# Altium project Sophia_Lake.PrjPcb (part 1 of 4)
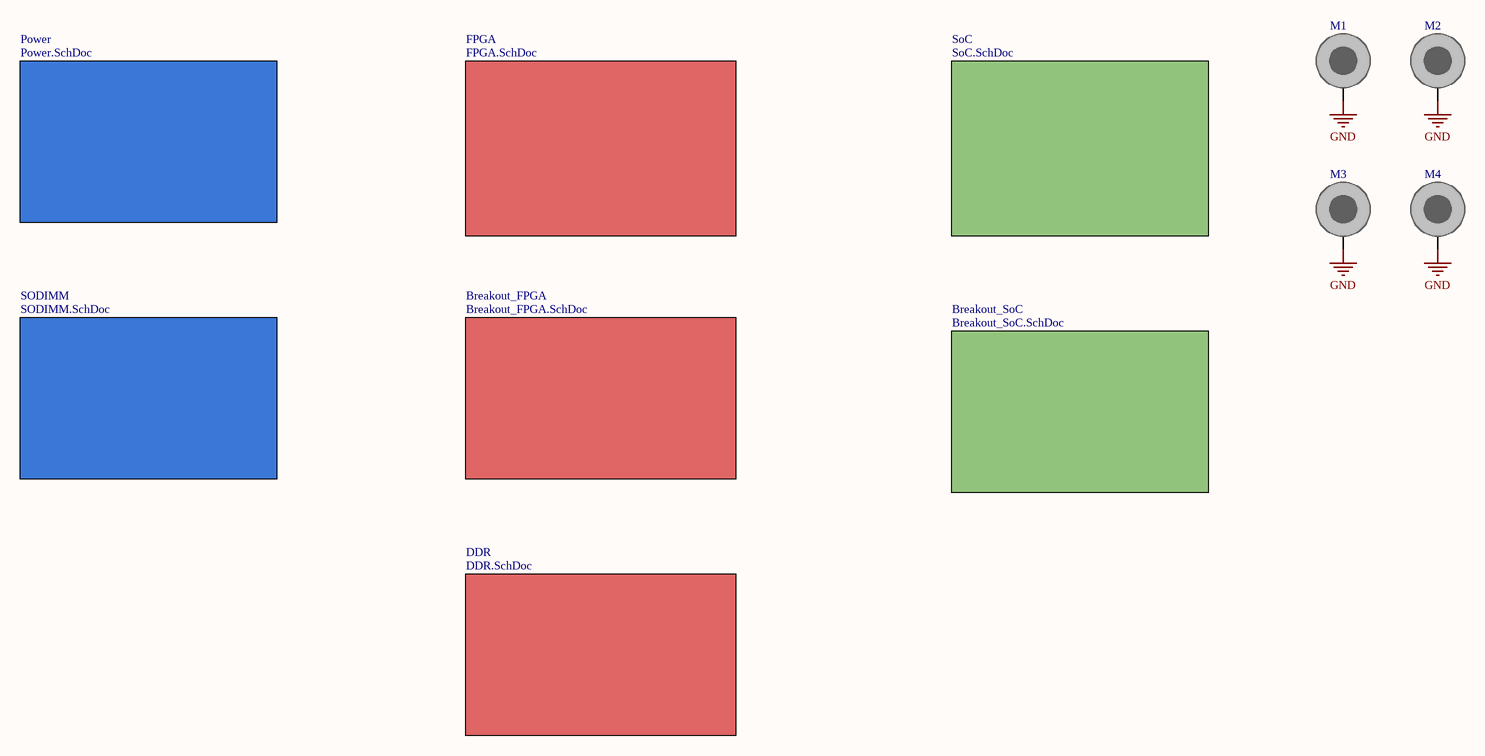
[diagram p0: Main.SchDoc]
8 sheets, 485 parts. Net scope: global (net labels, ports and power ports of the same name join across sheets).
Board file: Sophia_Lake.PcbDoc
Sheets:
  Main.SchDoc
    Breakout_SoC = Breakout_SoC.SchDoc
    Power = Power.SchDoc
    SODIMM = SODIMM.SchDoc
    FPGA = FPGA.SchDoc
    DDR = DDR.SchDoc
    SoC = SoC.SchDoc
    Breakout_FPGA = Breakout_FPGA.SchDoc

## Sheet Main.SchDoc
size C; DocumentNumber: 1; SheetNumber: 1; SheetTotal: 8

### Parts
M1  DNP/MH  [SCH_M3]  (value not drawn)  (no BOM)
M2  DNP/MH  [SCH_M3]  (value not drawn)  (no BOM)
M3  DNP/MH  [SCH_M3]  (value not drawn)  (no BOM)
M4  DNP/MH  [SCH_M3]  (value not drawn)  (no BOM)

### Sub-sheets
Breakout_FPGA = Breakout_FPGA.SchDoc: no entries
Breakout_SoC = Breakout_SoC.SchDoc: no entries
DDR = DDR.SchDoc: no entries
FPGA = FPGA.SchDoc: no entries
Power = Power.SchDoc: no entries
SoC = SoC.SchDoc: no entries
SODIMM = SODIMM.SchDoc: no entries

### Nets
GND: M1.1 M2.1 M3.1 M4.1

### Library data of the parts
M1-M4 = SCMH_M3: SCREW mouting, M3, 3.0mm diameter and 6.0mm PanHead; ASSEMBLY: DNP; VALUE: DNP/MH

## Sheet Breakout_SoC.SchDoc
size C; DocumentNumber: 8; SheetNumber: 8; SheetTotal: 8
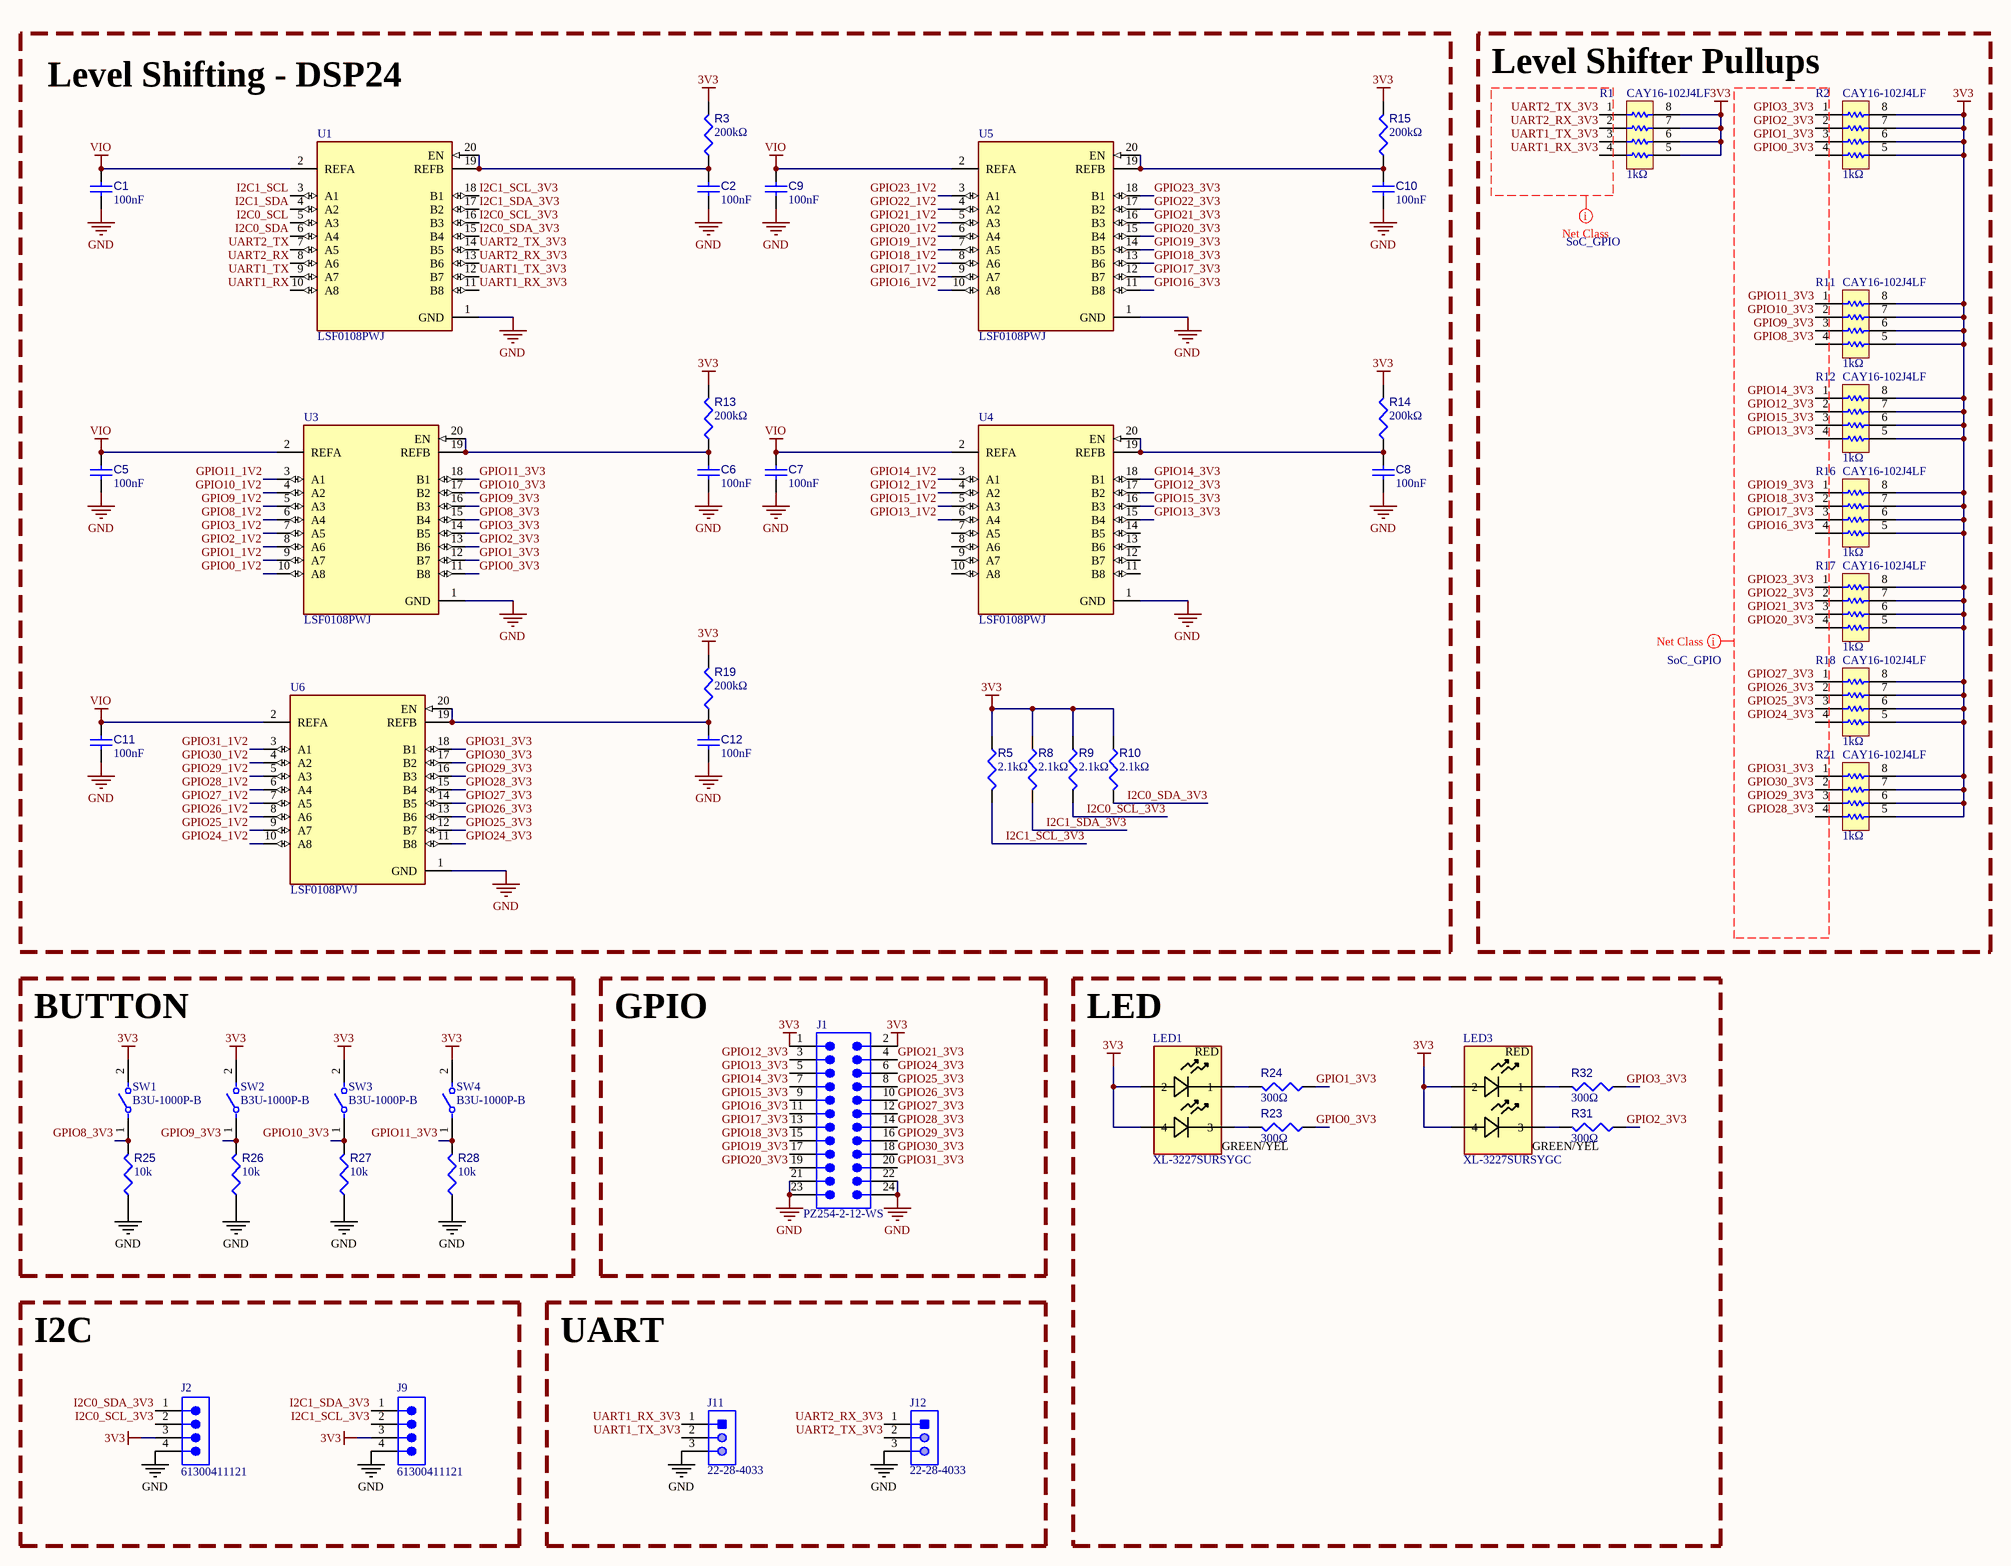
[diagram p1: Breakout_SoC.SchDoc]

### Parts
C1  value 100nF  [CAP-0402-MFG]  (hidden comment: CL05B104KO5VPNC)
C2  value 100nF  [CAP-0402-MFG]  (hidden comment: CL05B104KO5VPNC)
C5  value 100nF  [CAP-0402-MFG]  (hidden comment: CL05B104KO5VPNC)
C6  value 100nF  [CAP-0402-MFG]  (hidden comment: CL05B104KO5VPNC)
C7  value 100nF  [CAP-0402-MFG]  (hidden comment: CL05B104KO5VPNC)
C8  value 100nF  [CAP-0402-MFG]  (hidden comment: CL05B104KO5VPNC)
C9  value 100nF  [CAP-0402-MFG]  (hidden comment: CL05B104KO5VPNC)
C10  value 100nF  [CAP-0402-MFG]  (hidden comment: CL05B104KO5VPNC)
C11  value 100nF  [CAP-0402-MFG]  (hidden comment: CL05B104KO5VPNC)
C12  value 100nF  [CAP-0402-MFG]  (hidden comment: CL05B104KO5VPNC)
J1  PZ254-2-12-WS  [610124249121]
J2  61300411121  [61300411121]
J9  61300411121  [61300411121]
J11  22-28-4033  [MOLX-22-28-4033_V]
J12  22-28-4033  [MOLX-22-28-4033_V]
LED1  XL-3227SURSYGC  [LED-1210-4P-MFG]
LED3  XL-3227SURSYGC  [LED-1210-4P-MFG]
R1  CAY16-102J4LF  value 1kΩ  [RES-4x0603-MFG]
R2  CAY16-102J4LF  value 1kΩ  [RES-4x0603-MFG]
R3  value 200kΩ  [RES-0402]  (hidden comment: AC0402FR-07200KL)
R5  value 2.1kΩ  [RES-0402]  (hidden comment: CRCW04022K10FKED)
R8  value 2.1kΩ  [RES-0402]  (hidden comment: CRCW04022K10FKED)
R9  value 2.1kΩ  [RES-0402]  (hidden comment: CRCW04022K10FKED)
R10  value 2.1kΩ  [RES-0402]  (hidden comment: CRCW04022K10FKED)
R11  CAY16-102J4LF  value 1kΩ  [RES-4x0603-MFG]
R12  CAY16-102J4LF  value 1kΩ  [RES-4x0603-MFG]
R13  value 200kΩ  [RES-0402]  (hidden comment: AC0402FR-07200KL)
R14  value 200kΩ  [RES-0402]  (hidden comment: AC0402FR-07200KL)
R15  value 200kΩ  [RES-0402]  (hidden comment: AC0402FR-07200KL)
R16  CAY16-102J4LF  value 1kΩ  [RES-4x0603-MFG]
R17  CAY16-102J4LF  value 1kΩ  [RES-4x0603-MFG]
R18  CAY16-102J4LF  value 1kΩ  [RES-4x0603-MFG]
R19  value 200kΩ  [RES-0402]  (hidden comment: AC0402FR-07200KL)
R21  CAY16-102J4LF  value 1kΩ  [RES-4x0603-MFG]
R23  value 300Ω  [RES-0402]  (hidden comment: AC0402FR-07300RL)
R24  value 300Ω  [RES-0402]  (hidden comment: AC0402FR-07300RL)
R25  value 10k  [RES-0402]  (hidden comment: AC0402FR-0710KL)
R26  value 10k  [RES-0402]  (hidden comment: AC0402FR-0710KL)
R27  value 10k  [RES-0402]  (hidden comment: AC0402FR-0710KL)
R28  value 10k  [RES-0402]  (hidden comment: AC0402FR-0710KL)
R31  value 300Ω  [RES-0402]  (hidden comment: AC0402FR-07300RL)
R32  value 300Ω  [RES-0402]  (hidden comment: AC0402FR-07300RL)
SW1  B3U-1000P-B  [FP-B3U-1000P-B-MFG]
SW2  B3U-1000P-B  [FP-B3U-1000P-B-MFG]
SW3  B3U-1000P-B  [FP-B3U-1000P-B-MFG]
SW4  B3U-1000P-B  [FP-B3U-1000P-B-MFG]
U1  LSF0108PWJ  [FP-TSSOP20-MFG]
U3  LSF0108PWJ  [FP-TSSOP20-MFG]
U4  LSF0108PWJ  [FP-TSSOP20-MFG]
U5  LSF0108PWJ  [FP-TSSOP20-MFG]
U6  LSF0108PWJ  [FP-TSSOP20-MFG]

### Blocks framed on the sheet
Level Shifting - DSP24: C1 C2 C5-C12 R3 R5 R8-R10 R13-R15 R19 U1 U3-U6
Level Shifter Pullups: R1 R2 R11 R12 R16-R18 R21
BUTTON: R25-R28 SW1-SW4
GPIO: J1
LED: LED1 LED3 R23 R24 R31 R32
I2C: J2 J9
UART: J11 J12

### Nets
3V3: J1.1 J1.2 J2.3 J9.3 LED1.2 LED1.4 LED3.2 LED3.4 R1.5 R1.6 R1.7 R1.8 R2.5 R2.6 R2.7 R2.8 R3.2 R5.1 R8.1 R9.1 R10.1 R11.5 R11.6 R11.7 R11.8 R12.5 R12.6 R12.7 R12.8 R13.2 R14.2 R15.2 R16.5 R16.6 R16.7 R16.8 R17.5 R17.6 R17.7 R17.8 R18.5 R18.6 R18.7 R18.8 R19.2 R21.5 R21.6 R21.7 R21.8 SW1.2 SW2.2 SW3.2 SW4.2
GND: C1.1 C2.2 C5.1 C6.2 C7.1 C8.2 C9.1 C10.2 C11.2 C12.2 J1.21 J1.22 J1.23 J1.24 J2.4 J9.4 J11.3 J12.3 R25.1 R26.1 R27.1 R28.1 U1.1(GND) U3.1(GND) U4.1(GND) U5.1(GND) U6.1(GND)
VIO: C1.2 C5.2 C7.2 C9.2 C11.1 U1.2(REFA) U3.2(REFA) U4.2(REFA) U5.2(REFA) U6.2(REFA)
GPIO0_1V2: U3.10(A8)
GPIO0_3V3: R2.4 R23.2 U3.11(B8)
GPIO1_1V2: U3.9(A7)
GPIO1_3V3: R2.3 R24.2 U3.12(B7)
GPIO2_1V2: U3.8(A6)
GPIO2_3V3: R2.2 R31.2 U3.13(B6)
GPIO3_1V2: U3.7(A5)
GPIO3_3V3: R2.1 R32.2 U3.14(B5)
GPIO8_1V2: U3.6(A4)
GPIO8_3V3: R11.4 R25.2 SW1.1 U3.15(B4)
GPIO9_1V2: U3.5(A3)
GPIO9_3V3: R11.3 R26.2 SW2.1 U3.16(B3)
GPIO10_1V2: U3.4(A2)
GPIO10_3V3: R11.2 R27.2 SW3.1 U3.17(B2)
GPIO11_1V2: U3.3(A1)
GPIO11_3V3: R11.1 R28.2 SW4.1 U3.18(B1)
GPIO12_1V2: U4.4(A2)
GPIO12_3V3: J1.3 R12.2 U4.17(B2)
GPIO13_1V2: U4.6(A4)
GPIO13_3V3: J1.5 R12.4 U4.15(B4)
GPIO14_1V2: U4.3(A1)
GPIO14_3V3: J1.7 R12.1 U4.18(B1)
GPIO15_1V2: U4.5(A3)
GPIO15_3V3: J1.9 R12.3 U4.16(B3)
GPIO16_1V2: U5.10(A8)
GPIO16_3V3: J1.11 R16.4 U5.11(B8)
GPIO17_1V2: U5.9(A7)
GPIO17_3V3: J1.13 R16.3 U5.12(B7)
GPIO18_1V2: U5.8(A6)
GPIO18_3V3: J1.15 R16.2 U5.13(B6)
GPIO19_1V2: U5.7(A5)
GPIO19_3V3: J1.17 R16.1 U5.14(B5)
GPIO20_1V2: U5.6(A4)
GPIO20_3V3: J1.19 R17.4 U5.15(B4)
GPIO21_1V2: U5.5(A3)
GPIO21_3V3: J1.4 R17.3 U5.16(B3)
GPIO22_1V2: U5.4(A2)
GPIO22_3V3: R17.2 U5.17(B2)
GPIO23_1V2: U5.3(A1)
GPIO23_3V3: R17.1 U5.18(B1)
GPIO24_1V2: U6.10(A8)
GPIO24_3V3: J1.6 R18.4 U6.11(B8)
GPIO25_1V2: U6.9(A7)
GPIO25_3V3: J1.8 R18.3 U6.12(B7)
GPIO26_1V2: U6.8(A6)
GPIO26_3V3: J1.10 R18.2 U6.13(B6)
GPIO27_1V2: U6.7(A5)
GPIO27_3V3: J1.12 R18.1 U6.14(B5)
GPIO28_1V2: U6.6(A4)
GPIO28_3V3: J1.14 R21.4 U6.15(B4)
GPIO29_1V2: U6.5(A3)
GPIO29_3V3: J1.16 R21.3 U6.16(B3)
GPIO30_1V2: U6.4(A2)
GPIO30_3V3: J1.18 R21.2 U6.17(B2)
GPIO31_1V2: U6.3(A1)
GPIO31_3V3: J1.20 R21.1 U6.18(B1)
I2C0_SCL: U1.5(A3)
I2C0_SCL_3V3: J2.2 R9.2 U1.16(B3)
I2C0_SDA: U1.6(A4)
I2C0_SDA_3V3: J2.1 R10.2 U1.15(B4)
I2C1_SCL: U1.3(A1)
I2C1_SCL_3V3: J9.2 R5.2 U1.18(B1)
I2C1_SDA: U1.4(A2)
I2C1_SDA_3V3: J9.1 R8.2 U1.17(B2)
UART1_RX: U1.10(A8)
UART1_RX_3V3: J11.1 R1.4 U1.11(B8)
UART1_TX: U1.9(A7)
UART1_TX_3V3: J11.2 R1.3 U1.12(B7)
UART2_RX: U1.8(A6)
UART2_RX_3V3: J12.1 R1.2 U1.13(B6)
UART2_TX: U1.7(A5)
UART2_TX_3V3: J12.2 R1.1 U1.14(B5)
NetC2_1: C2.1 R3.1 U1.19(REFB) U1.20(EN)
NetC6_1: C6.1 R13.1 U3.19(REFB) U3.20(EN)
NetC8_1: C8.1 R14.1 U4.19(REFB) U4.20(EN)
NetC10_1: C10.1 R15.1 U5.19(REFB) U5.20(EN)
NetC12_1: C12.1 R19.1 U6.19(REFB) U6.20(EN)
NetLED1_1: LED1.1 R24.1
NetLED1_3: LED1.3 R23.1
NetLED3_1: LED3.1 R32.1
NetLED3_3: LED3.3 R31.1

Not connected (* = marked no-connect by the designer): U4 7(A5) 8(A6) 9(A7) 10(A8) 11(B8) 12(B7) 13(B6) 14(B5)

### Layout directives
net class SoC_GPIO: GPIO0_3V3, GPIO1_3V3, GPIO2_3V3, GPIO3_3V3, GPIO8_3V3, GPIO9_3V3, GPIO10_3V3, GPIO11_3V3, GPIO12_3V3, GPIO13_3V3, GPIO14_3V3, GPIO15_3V3, GPIO16_3V3, GPIO17_3V3, GPIO18_3V3, GPIO19_3V3, GPIO20_3V3, GPIO21_3V3, GPIO22_3V3, GPIO23_3V3, GPIO24_3V3, GPIO25_3V3, GPIO26_3V3, GPIO27_3V3, GPIO28_3V3, GPIO29_3V3, GPIO30_3V3, GPIO31_3V3, UART1_RX_3V3, UART1_TX_3V3, UART2_RX_3V3, UART2_TX_3V3

### Notes on the sheet
- (in symbol CMP-132-000003-3) RED; GREEN/YEL

### Library data of the parts
C1 C2 C5-C12 = CMP-104-000086-6: 0402-100n-10%-16V-X7R-AECQ200; Manufacturer Name: Murata; Capacitor Type: Ceramic; Voltage Rating: 16V; Tolerance: 10%; Temp Code: X7R; Component Type: Standard; Min Operating Temperature: -55°C; Source: Components - 11.02.26 - 17.26.SchLib; Design Item ID: CMP-001-00111-7; Pin Count: 2; Max Operating Temperature: 125°C; Case/Package: 0402; Pins: 2; Info: 0402-100n-10%-16V-X7R-AECQ200; Manufacturer Part Number: CL05B104KO5VPNC; Mounting Technology: Surface Mount; JLC PN: C307332
J1 = CMP-055-000215-1: Pin Header, 2.54MM Pitch, SMT Double Row Right Angled, 24 Pins; Manufacturer Name: HCTL; Current Rating: 3A; Connector Type: Male Pin; Gender: Male; Operating Supply Voltage: 250V; Pitch: 2.54mm; Termination: Solder; Number of Rows: 2; Pins: 24; Mounting Technology: Surface Mount; JLC PN: C5149362; Max Operating Temperature: 105°C; Manufacturer Part Number: PZ254-2-12-WS; Min Operating Temperature: -40°C
J2 J9 = CMP-00022-2: Conn Unshrouded Header HDR 4 POS 2.54mm Solder ST Thru-Hole Bag; Manufacturer Name: Wurth Electronik; Contact Resistance: 20mΩ; Current Rating: 3A; Voltage Rating: 250V; Connector Type: Male Pin; Gender: Male; Number of Rows: 1; Pitch: 2.54mm; Termination: Solder; Min Operating Temperature: -40°C; Max Operating Temperature: 105°C; JLC PN: C5184785; Manufacturer Part Number: 61300411121; Mounting Technology: Through Hole; Pins: 4
J11 J12 = CMP-055-000016-2: Board Connector, 3 Contact(s), 1 Row(s), Male, Straight, 0.1 inch Pitch, Solder Terminal, Receptacle; Manufacturer Name: Molex; JLC PN: 587037; Manufacturer Part Number: 22-28-4033
LED1 LED3 = CMP-132-000003-3: LED indicator light dual color red yellow green 1210 front facing; Manufacturer Name: XINLIGHT; Manufacturer Part Number: XL-3227SURSYGC; JLC PN: C965843
R1 R2 R11 R12 R16-R18 R21 = CMP-014-000102-1: Res Thick Film Array 1K Ohm 5% 0.25W(1/4W) ±200ppm/C ISOL 8-Pin 1206(4 X 0603) Convex SMD T/R; Manufacturer Name: Bourns; Number of Resistors: 4; Voltage Rating (DC): 50V; Power Dissipation: 250mW; Mounting Technology: Surface Mount; Tolerance: 5%; Manufacturer Part Number: CAY16-102J4LF; Min Operating Temperature: -55°C; JLC PN: C784824; Case/Package: 0603; Max Operating Temperature: 125°C; Pins: 8
R3 R13-R15 R19 = CMP-014-000126-4: 0402-200k-1%-1/16W-AEC-Q200; Manufacturer Name: YAGEO; Tolerance: 1%; Power: 63mW; Voltage Rating: 50V; Design Item ID: CMP-009-00210-1; Case/Package: 0402; Source: Components - 11.02.26 - 17.27.SchLib; Mounting Technology: Surface Mount; Min Operating Temperature: -55°C; Info: 0402-200k-1%-1/16W-AEC-Q200; Max Operating Temperature: 155°C; Pins: 2; Manufacturer Part Number: AC0402FR-07200KL; JLC PN: C144785
R5 R8-R10 = CMP-014-000127-3: 0402-2.1k-1%-1/16W-AEC-Q200; Manufacturer Name: Vishay; Power: 63mW; Tolerance: 1%; Voltage Rating: 50V; Max Operating Temperature: 155°C; Pins: 2; Design Item ID: CMP-009-00190-1; Info: 0402-2.1k-1%-1/16W-AEC-Q200; Manufacturer Part Number: CRCW04022K10FKED; Mounting Technology: Surface Mount; Component Type: Standard; Case/Package: 0402; Source: Components - 11.02.26 - 17.27.SchLib; Min Operating Temperature: -55°C; Pin Count: 2; JLC PN: C2091566
R23 R24 R31 R32 = CMP-014-000122-4: 0402-300-1%-1/16W-AEC-Q200; Manufacturer Name: YAGEO; Voltage Rating: 50V; Power: 63mW; Tolerance: 1%; Case/Package: 0402; Info: 0402-300-1%-1/16W-AEC-Q200; Pins: 2; Source: Components - 11.02.26 - 17.27.SchLib; Manufacturer Part Number: AC0402FR-07300RL; Max Operating Temperature: 155°C; Mounting Technology: Surface Mount; Design Item ID: CMP-009-00210-1; Min Operating Temperature: -55°C; JLC PN: C144768
R25-R28 = CMP-014-000077-5: 0402-10k-1%-1/16W-AEC-Q200; Manufacturer Name: YAGEO; Tolerance: 1%; Voltage Rating: 50V; Power: 63mW; Pins: 2; Source: Components - 11.02.26 - 17.27.SchLib; Manufacturer Part Number: AC0402FR-0710KL; Info: 0402-10k-1%-1/16W-AEC-Q200; Min Operating Temperature: -55°C; Pin Count: 2; Case/Package: 0402; Design Item ID: CMP-009-00191-3; Max Operating Temperature: 155°C; Component Type: Standard; Mounting Technology: Surface Mount; JLC PN: C144807
SW1-SW4 = CMP-015-000062-1: Switch Tactile N.O. SPST Round Button Gull Wing 0.05A 12VDC 1.5N SMD Embossed T/R; Manufacturer Name: Omron; Contact Resistance: 100mΩ; Switch Function: Off-Mom; Max Current Rating: 50mA; Voltage Rating (DC): 12V; Manufacturer Part Number: B3U-1000P-B; Switch Type: SPST; Max Operating Temperature: 70°C; Mounting Technology: Surface Mount; JLC PN: C231329; Min Operating Temperature: -25°C
U1 U3-U6 = CMP-051-000053-3: LSF0108 - 8-bit bidirectional multi-voltage level translator; open-drain; push-pull; Manufacturer Name: Nexperia; Operating Supply Current: 128mA; Number of Channels: 8; Min Supply Voltage: 950mV; Data Rate: 200Mbps; Max Supply Voltage: 5V; Topology: Open-Drain, Push-Pull; Pins: 20; Logic Function: Translator; Max Operating Temperature: 125°C; Min Operating Temperature: -40°C; Mounting Technology: Surface Mount; Channel Type: Bidirectional; JLC PN: C551522; Case/Package: TSSOP; Height: 1.1mm; Manufacturer Part Number: LSF0108PWJ

## Sheet Power.SchDoc
size C; DocumentNumber: 3; SheetNumber: 3; SheetTotal: 8
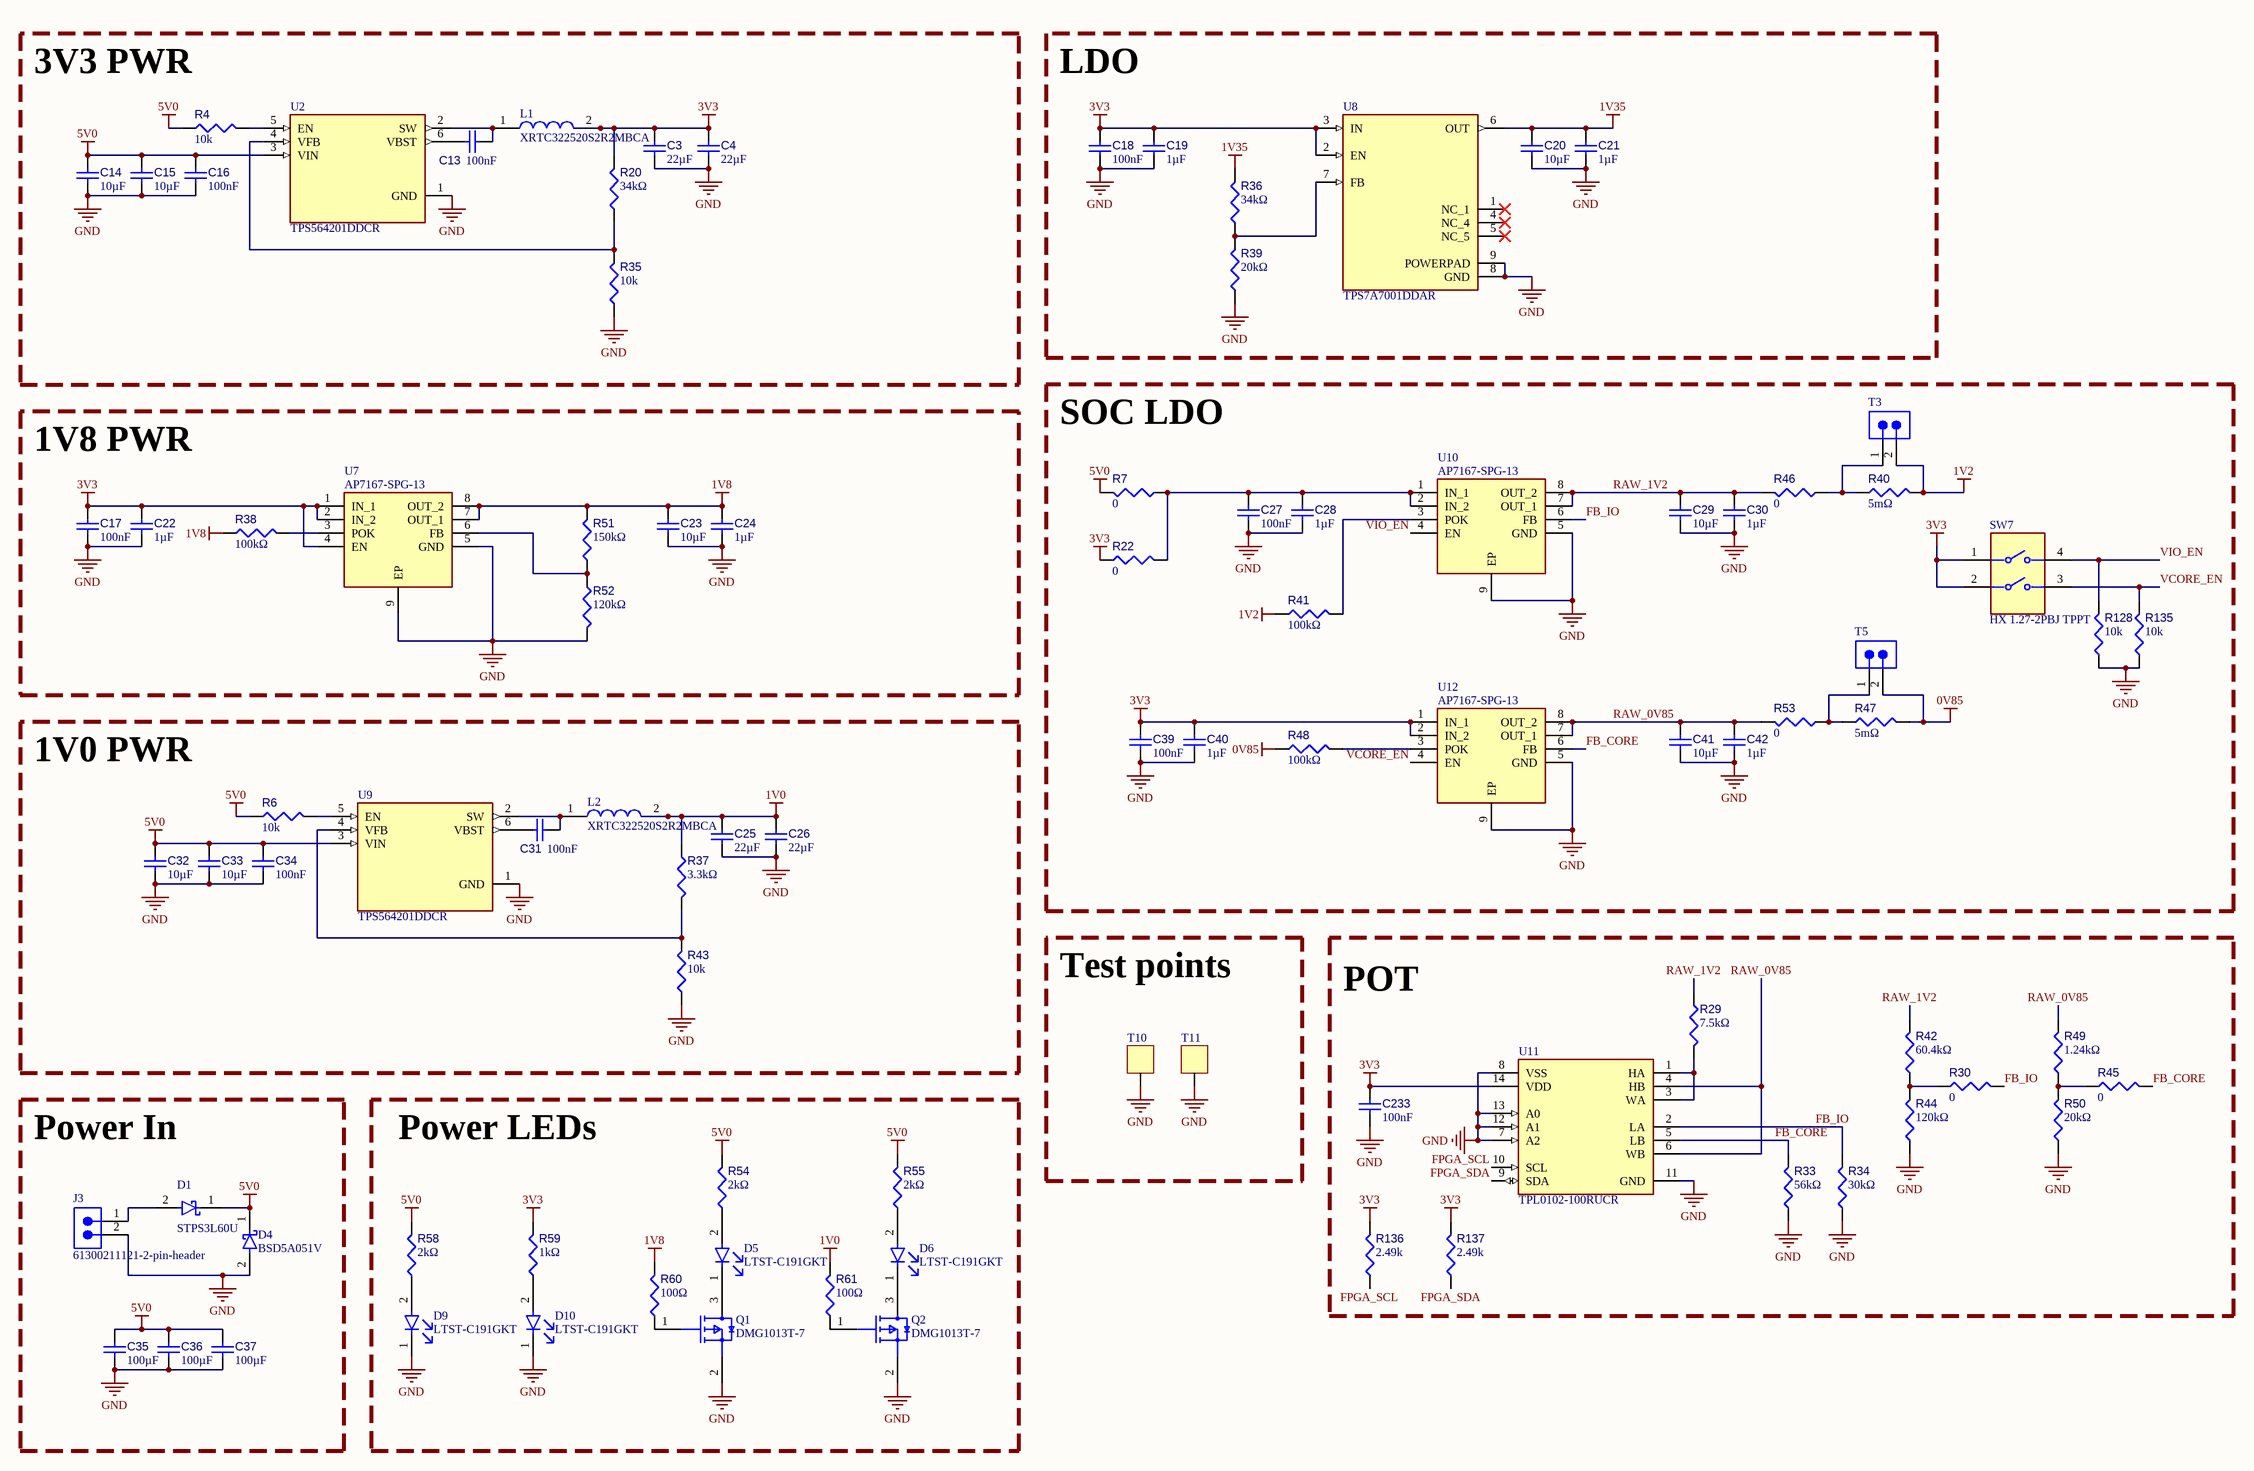
[diagram p2: Power.SchDoc]

### Parts
C3  value 22µF  [CAP-0603-MFG]  (hidden comment: CL10A226MO7JZNC)
C4  value 22µF  [CAP-0603-MFG]  (hidden comment: CL10A226MO7JZNC)
C13  value 100nF  [CAP-0402-MFG]  (hidden comment: CL05B104KA54PNC)
C14  value 10µF  [CAP-0402-MFG]  (hidden comment: CL05A106MP5NUNC)
C15  value 10µF  [CAP-0402-MFG]  (hidden comment: CL05A106MP5NUNC)
C16  value 100nF  [CAP-0402-MFG]  (hidden comment: CL05B104KA54PNC)
C17  value 100nF  [CAP-0402-MFG]  (hidden comment: CL05B104KA54PNC)
C18  value 100nF  [CAP-0402-MFG]  (hidden comment: CL05B104KA54PNC)
C19  value 1µF  [CAP-0402-MFG]  (hidden comment: GRT155C81C105KE13J)
C20  value 10µF  [CAP-0402-MFG]  (hidden comment: CL05A106MP5NUNC)
C21  value 1µF  [CAP-0402-MFG]  (hidden comment: GRT155C81C105KE13J)
C22  value 1µF  [CAP-0402-MFG]  (hidden comment: GRT155C81C105KE13J)
C23  value 10µF  [CAP-0402-MFG]  (hidden comment: CL05A106MP5NUNC)
C24  value 1µF  [CAP-0402-MFG]  (hidden comment: GRT155C81C105KE13J)
C25  value 22µF  [CAP-0603-MFG]  (hidden comment: CL10A226MO7JZNC)
C26  value 22µF  [CAP-0603-MFG]  (hidden comment: CL10A226MO7JZNC)
C27  value 100nF  [CAP-0402-MFG]  (hidden comment: CL05B104KA54PNC)
C28  value 1µF  [CAP-0402-MFG]  (hidden comment: GRT155C81C105KE13J)
C29  value 10µF  [CAP-0402-MFG]  (hidden comment: CL05A106MP5NUNC)
C30  value 1µF  [CAP-0402-MFG]  (hidden comment: GRT155C81C105KE13J)
C31  value 100nF  [CAP-0402-MFG]  (hidden comment: CL05B104KA54PNC)
C32  value 10µF  [CAP-0402-MFG]  (hidden comment: CL05A106MP5NUNC)
C33  value 10µF  [CAP-0402-MFG]  (hidden comment: CL05A106MP5NUNC)
C34  value 100nF  [CAP-0402-MFG]  (hidden comment: CL05B104KA54PNC)
C35  value 100µF  [CAP-0805-MFG]  (hidden comment: GRM21BR60J107ME15L)
C36  value 100µF  [CAP-0805-MFG]  (hidden comment: GRM21BR60J107ME15L)
C37  value 100µF  [CAP-0805-MFG]  (hidden comment: GRM21BR60J107ME15L)
C39  value 100nF  [CAP-0402-MFG]  (hidden comment: CL05B104KA54PNC)
C40  value 1µF  [CAP-0402-MFG]  (hidden comment: GRT155C81C105KE13J)
C41  value 10µF  [CAP-0402-MFG]  (hidden comment: CL05A106MP5NUNC)
C42  value 1µF  [CAP-0402-MFG]  (hidden comment: GRT155C81C105KE13J)
C233  value 100nF  [CAP-0402-MFG]  (hidden comment: CL05B104KA54PNC)
D1  STPS3L60U  [FP-DO214AA-MFG]
D4  BSD5A051V  [SOD-523]
D5  LTST-C191GKT  [LED-0603-MFG]
D6  LTST-C191GKT  [LED-0603-MFG]
D9  LTST-C191GKT  [LED-0603-MFG]
D10  LTST-C191GKT  [LED-0603-MFG]
J3  61300211121-2-pin-header  [61300211121]
L1  XRTC322520S2R2MBCA  [INDC2520X100N]
L2  XRTC322520S2R2MBCA  [INDC2520X100N]
Q1  DMG1013T-7  [FP-SOT523-MFG]
Q2  DMG1013T-7  [FP-SOT523-MFG]
R4  value 10k  [RES-0402]  (hidden comment: AC0402FR-0710KL)
R6  value 10k  [RES-0402]  (hidden comment: AC0402FR-0710KL)
R7  value 0  [RES-0402]  (hidden comment: AC0402JR-130RL)
R20  value 34kΩ  [RES-0402]  (hidden comment: AC0402FR-0734KL)
R22  value 0  [RES-0402]  (hidden comment: AC0402JR-130RL)
R29  value 7.5kΩ  [RES-0402]  (hidden comment: AC0402FR-077K5L)
R30  value 0  [RES-0402]  (hidden comment: AC0402JR-130RL)
R33  value 56kΩ  [RES-0402]  (hidden comment: AF0402FR-0756KL)
R34  value 30kΩ  [RES-0402]  (hidden comment: AC0402FR-0730KL)
R35  value 10k  [RES-0402]  (hidden comment: AC0402FR-0710KL)
R36  value 34kΩ  [RES-0402]  (hidden comment: AC0402FR-0734KL)
R37  value 3.3kΩ  [RES-0402]  (hidden comment: CRCW04023K30FKED)
R38  value 100kΩ  [RES-0402]  (hidden comment: AC0402FR-07100KL)
R39  value 20kΩ  [RES-0402]  (hidden comment: AC0402FR-0720KL)
R40  value 5mΩ  [RES-0603-MFG]  (hidden comment: PA0603FRE570R005L)
R41  value 100kΩ  [RES-0402]  (hidden comment: AC0402FR-07100KL)
R42  value 60.4kΩ  [RES-0402]  (hidden comment: AC0402FR-0760K4L)
R43  value 10k  [RES-0402]  (hidden comment: AC0402FR-0710KL)
R44  value 120kΩ  [RES-0402]  (hidden comment: AC0402FR-07120KL)
R45  value 0  [RES-0402]  (hidden comment: AC0402JR-130RL)
R46  value 0  [RES-0603-MFG]  (hidden comment: AC0603FR-070RL)
R47  value 5mΩ  [RES-0603-MFG]  (hidden comment: PA0603FRE570R005L)
R48  value 100kΩ  [RES-0402]  (hidden comment: AC0402FR-07100KL)
R49  value 1.24kΩ  [RES-0402]  (hidden comment: AC0402FR-071K24L)
R50  value 20kΩ  [RES-0402]  (hidden comment: AC0402FR-0720KL)
R51  value 150kΩ  [RES-0402]  (hidden comment: AF0402FR-07150KL)
R52  value 120kΩ  [RES-0402]  (hidden comment: AC0402FR-07120KL)
R53  value 0  [RES-0603-MFG]  (hidden comment: AC0603FR-070RL)
R54  value 2kΩ  [RES-0402]  (hidden comment: AC0402FR-072KL)
R55  value 2kΩ  [RES-0402]  (hidden comment: AC0402FR-072KL)
R58  value 2kΩ  [RES-0402]  (hidden comment: AC0402FR-072KL)
R59  value 1kΩ  [RES-0402]  (hidden comment: AC0402FR-071KL)
R60  value 100Ω  [RES-0402]  (hidden comment: AC0402FR-07100RL)
R61  value 100Ω  [RES-0402]  (hidden comment: AC0402FR-07100RL)
R128  value 10k  [RES-0402]  (hidden comment: AC0402FR-0710KL)
R135  value 10k  [RES-0402]  (hidden comment: AC0402FR-0710KL)
R136  value 2.49k  [RES-0402]  (hidden comment: AC0402FR-072K49L)
R137  value 2.49k  [RES-0402]  (hidden comment: AC0402FR-072K49L)
SW7  HX 1.27-2PBJ TPPT  [HX 1.27-2PBJ TPPT-Footprint-1]
T3  61300211121-2-pin-header  [61300211121]  (value not drawn)
T5  61300211121-2-pin-header  [61300211121]  (value not drawn)
T10  TEST_PT  [TP-100X100/ROUND-THT]  (value not drawn)
T11  TEST_PT  [TP-100X100/ROUND-THT]  (value not drawn)
U2  TPS564201DDCR  [SOT95P280X110-6N]
U7  AP7167-SPG-13  [SOIC127P600X175-9N]
U8  TPS7A7001DDAR  [VREG_TPS7A7001DDAR]
U9  TPS564201DDCR  [SOT95P280X110-6N]
U10  AP7167-SPG-13  [SOIC127P600X175-9N]
U11  TPL0102-100RUCR  [FP-RUC0014A-IPC_B]
U12  AP7167-SPG-13  [SOIC127P600X175-9N]

### Blocks framed on the sheet
3V3 PWR: C3 C4 C13-C16 L1 R4 R20 R35 U2
LDO: C18-C21 R36 R39 U8
SOC LDO: C27-C30 C39-C42 R7 R22 R40 R41 R46-R48 R53 R128 R135 SW7 T3 T5 U10 U12
1V8 PWR: C17 C22-C24 R38 R51 R52 U7
1V0 PWR: C25 C26 C31-C34 L2 R6 R37 R43 U9
Test points: T10 T11
POT: C233 R29 R30 R33 R34 R42 R44 R45 R49 R50 R136 R137 U11
Power In: C35-C37 D1 D4 J3
Power LEDs: D5 D6 D9 D10 Q1 Q2 R54 R55 R58-R61

### Nets
0V85: R47.2 R48.1 T5.2
1V0: C25.1 C26.1 L2.2 R37.1 R61.2
1V2: R40.2 R41.1 T3.2
1V8: C23.1 C24.1 R38.1 R51.2 R60.2 U7.7(OUT_1) U7.8(OUT_2)
1V35: C20.2 C21.1 R36.2 U8.6(OUT)
3V3: C3.1 C4.1 C17.1 C18.1 C19.1 C22.1 C39.1 C40.1 C233.1 L1.2 R20.2 R22.1 R59.2 R136.2 R137.2 SW7.1 SW7.2 U7.1(IN_1) U7.2(IN_2) U7.4(EN) U8.2(EN) U8.3(IN) U11.14(VDD) U12.1(IN_1) U12.2(IN_2)
5V0: C14.1 C15.1 C16.1 C32.1 C33.2 C34.2 C35.1 C36.1 C37.1 D1.1(K) D4.1(K) R4.1 R6.1 R7.2 R54.2 R55.2 R58.2 U2.3(VIN) U9.3(VIN)
GND: C3.2 C4.2 C14.2 C15.2 C16.2 C17.2 C18.2 C19.2 C20.1 C21.2 C22.2 C23.2 C24.2 C25.2 C26.2 C27.2 C28.2 C29.2 C30.2 C32.2 C33.1 C34.1 C35.2 C36.2 C37.2 C39.2 C40.2 C41.2 C42.2 C233.2 D4.2(A) D9.1(C) D10.1(C) J3.2 Q1.2(S) Q2.2(S) R33.1 R34.1 R35.1 R39.1 R43.1 R44.1 R50.1 R52.2 R128.1 R135.1 T10.1 T11.1 U2.1(GND) U7.5(GND) U7.9(EP) U8.8(GND) U8.9(POWERPAD) U9.1(GND) U10.5(GND) U10.9(EP) U11.7(A2) U11.8(VSS) U11.11(GND) U11.12(A1) U11.13(A0) U12.5(GND) U12.9(EP)
FB_CORE: R33.2 R45.2 U11.5(LB) U12.6(FB)
FB_IO: R30.2 R34.2 U10.6(FB) U11.2(LA)
FPGA_SCL: R136.1 U11.10(SCL)
FPGA_SDA: R137.1 U11.9(SDA)
RAW_0V85: C41.1 C42.1 R49.2 R53.2 U11.4(HB) U11.6(WB) U12.7(OUT_1) U12.8(OUT_2)
RAW_1V2: C29.1 C30.1 R29.1 R42.2 R46.2 U10.7(OUT_1) U10.8(OUT_2)
VCORE_EN: R135.2 SW7.3 U12.4(EN)
VIO_EN: R128.2 SW7.4 U10.4(EN)
NetC13_1: C13.1 L1.1 U2.2(SW)
NetC13_2: C13.2 U2.6(VBST)
NetC27_1: C27.1 C28.1 R7.1 R22.2 U10.1(IN_1) U10.2(IN_2)
NetC31_1: C31.1 U9.6(VBST)
NetC31_2: C31.2 L2.1 U9.2(SW)
NetD1_2: D1.2(A) J3.1
NetD5_1: D5.1(C) Q1.3(D)
NetD5_2: D5.2(A) R54.1
NetD6_1: D6.1(C) Q2.3(D)
NetD6_2: D6.2(A) R55.1
NetD9_2: D9.2(A) R58.1
NetD10_2: D10.2(A) R59.1
NetQ1_1: Q1.1(G) R60.1
NetQ2_1: Q2.1(G) R61.1
NetR4_2: R4.2 U2.5(EN)
NetR6_2: R6.2 U9.5(EN)
NetR20_1: R20.1 R35.2 U2.4(VFB)
NetR29_2: R29.2 U11.1(HA) U11.3(WA)
NetR30_1: R30.1 R42.1 R44.2
NetR36_1: R36.1 R39.2 U8.7(FB)
NetR37_2: R37.2 R43.2 U9.4(VFB)
NetR38_2: R38.2 U7.3(POK)
NetR40_1: R40.1 R46.1 T3.1
NetR41_2: R41.2 U10.3(POK)
NetR45_1: R45.1 R49.1 R50.2
NetR47_1: R47.1 R53.1 T5.1
NetR48_2: R48.2 U12.3(POK)
NetR51_1: R51.1 R52.1 U7.6(FB)

Not connected (* = marked no-connect by the designer): U8 1(NC_1)* 4(NC_4)* 5(NC_5)*

### Library data of the parts
C3 C4 C25 C26 = CMP-104-000117-3: 0603-22u-20%-16V-X5R; Manufacturer Name: Samsung Electro-Mechanics; Tolerance: 20%; Voltage Rating: 16V; Capacitor Type: Ceramic; JLC PN: C2762594; Manufacturer Part Number: CL10A226MO7JZNC; Component Type: Standard; Mounting Technology: Surface Mount; Pins: 2; Pin Count: 2; Design Item ID: CMP-001-00130-1; Info: 0603-22u-20%-16V-X5R; Source: Components - 11.02.26 - 17.26.SchLib; Min Operating Temperature: -55°C; Max Operating Temperature: 85°C; Case/Package: 0603
C13 C16 C31 C34 = CMP-104-000104-6: 0402-100n-10%-25V-X7R-AECQ200; Manufacturer Name: Samsung; Tolerance: 10%; Voltage Rating: 25V; Capacitor Type: Ceramic; Temp Code: X7R; Min Operating Temperature: -55°C; Mounting Technology: Surface Mount; Case/Package: 0402; Max Operating Temperature: 125°C; Pins: 2; Manufacturer Part Number: CL05B104KA54PNC; Design Item ID: CMP-001-00131-1; Source: Components - 11.02.26 - 17.26.SchLib; Info: 0402-100n-10%-25V-X7R-AECQ200; Pin Count: 2; Component Type: Standard; JLC PN: C346180
C14 C15 C20 C23 C29 C32 C33 C41 = CMP-104-000115-6: 0402-10u-20%-10V-X5R; Manufacturer Name: Samsung Electro-Mechanics; Temp Code: X5R; Voltage Rating: 10V; Tolerance: 20%; Capacitor Type: Ceramic; Info: 0402-10u-20%-10V-X5R; Case/Package: 0402; Pins: 2; Max Operating Temperature: 85°C; Mounting Technology: Surface Mount; JLC PN: C315248; Min Operating Temperature: -55°C; Design Item ID: CMP-001-00111-7; Pin Count: 2; Component Type: Standard; Source: Components - 11.02.26 - 17.26.SchLib; Manufacturer Part Number: CL05A106MP5NUNC
C17 C18 C27 C39 C233 = CMP-104-000104-6: 0402-100n-10%-25V-X7R-AECQ200; Manufacturer Name: Samsung; Capacitor Type: Ceramic; Voltage Rating: 25V; Tolerance: 10%; Temp Code: X7R; Min Operating Temperature: -55°C; Component Type: Standard; Max Operating Temperature: 125°C; Case/Package: 0402; Info: 0402-100n-10%-25V-X7R-AECQ200; Pins: 2; Pin Count: 2; Mounting Technology: Surface Mount; Manufacturer Part Number: CL05B104KA54PNC; Design Item ID: CMP-001-00131-1; Source: Components - 11.02.26 - 17.26.SchLib; JLC PN: C346180
C19 C21 C22 C24 C28 C30 C40 C42 = CMP-104-000087-6: 0402-1u-10%-16V-X6S-AECQ200; Manufacturer Name: Murata; Temp Code: X6S; Voltage Rating: 16V; Capacitor Type: Ceramic; Tolerance: 10%; Min Operating Temperature: -55°C; Pin Count: 2; Design Item ID: CMP-001-00112-5; Manufacturer Part Number: GRT155C81C105KE13J; Info: 0402-1u-10%-16V-X6S-AECQ200; Mounting Technology: Surface Mount; Component Type: Standard; Case/Package: 0402; Source: Components - 11.02.26 - 17.26.SchLib; Max Operating Temperature: 105°C; Pins: 2; JLC PN: C908010
C35-C37 = CMP-104-000118-4: 0805-100u-20%-6.3V-X5R; Manufacturer Name: Murata; Voltage Rating: 6.3V; Temp Code: X5R; Capacitor Type: Ceramic; Tolerance: 20%; Design Item ID: CMP-001-00132-1; Source: Components - 11.02.26 - 17.26.SchLib; Min Operating Temperature: -55°C; Info: 0805-100u-20%-6.3V-X5R; Mounting Technology: Surface Mount; JLC PN: C141660; Case/Package: 0805; Component Type: Standard; Pin Count: 2; Max Operating Temperature: 85°C; Manufacturer Part Number: GRM21BR60J107ME15L; Pins: 2
D1 = CMP-090-000051-3: DO214AA-UNI-SCHOTTKY-60V-3A-590mV; Manufacturer Name: STMicroelectronics; Forward Current: 3A; Reverse Standoff Voltage: 60V; Max Reverse Leakage Current: 150µA; Forward Voltage: 590mV; Max Operating Temperature: 150°C; Min Operating Temperature: -65°C; Mounting Technology: Surface Mount; Case/Package: DO-214AA, SMB; Info: DO214AA-UNI-SCHOTTKY-60V-3A-590mV; JLC PN: C132769; Manufacturer Part Number: STPS3L60U
D4 = CMP-090-000052-2: TVS ESD protection clamp generic; Manufacturer Name: BORN; Source: BWRC.SchLib; Package: SOD-523; Design Item ID: DISCRETE_TVS; JLC PN: C151987; Manufacturer Part Number: BSD5A051V
D5 D6 D9 D10 = CMP-132-000002-2: LED yellow green 0603 wavelength 569nm light intensity 12mcd Front Mounting; Manufacturer Name: Lite-On; Forward Current: 30mA; Viewing Angle: 130°; Power Rating: 100mW; Forward Voltage: 2.6V; Pins: 2; JLC PN: C99289; Color: Green; Max Operating Temperature: 85°C; Wavelength: 569nm; Manufacturer Part Number: LTST-C191GKT; Case/Package: 0603; Min Operating Temperature: -55°C; Mounting Technology: Surface Mount
J3 = CMP-00023-3: Board Connector, 2 Contact(s), 1 Row(s), Male, Straight, 0.1 inch Pitch, Solder Terminal, Locking, Black Insulator, Plug; Manufacturer Name: Wurth Electronik; Number Of Connectors: 1; Rated Current (Signal): 3A; Reference Standard: UL; PCB Contact Pattern: RECTANGULAR; Body Length: 0.2inch; DIN Conformance: No; Option: General Purpose; Number of Contacts: 2; Contact Style: SQ PIN-SKT; Dielectric Withstanding Voltage (AC): 500V; Contact Resistance: 20mR; Reliability: COMMERCIAL; Insulation Resistance: 1GR; Mounting Technology: Board; Mating Contact Pitch: 0.1inch; Insulation Material: Polybutylene; Terminal Length: 0.118inch; RoHS Compliant: Yes; Body/Shell Style: PLUG; Flammability Rating: UL94 V-0; Body Breadth: 0.1inch; Termination: Solder; Manufacturer Part Number: 61300211121; Max Operating Temperature: 125°C; Mounting Style: STRAIGHT; IEC Conformance: No; JLC PN: C2915055; Number of Rows Loaded: 1; Contact Material: Copper Alloy; Min Operating Temperature: -40°C; Contact Pattern: RECTANGULAR; MIL Conformance: No; Contact Finish - Mating: GOLD; Body Depth: 0.1inch; Connector Type: BOARD CONNECTOR; Mixed Contacts: No; Terminal Pitch: 2.54mm; Insulation Color: Black; Contact Finish - Termination: Gold (Au) - with Nickel (Ni) barrier; Reach SVHC Compliant: Yes; JESD-609 Code: e4; Contact Gender: Male; Filter Feature: No; Mounting Option 1: LOCKING
L1 L2 = CMP-009-000011-4: Ind,3.2x2.5x1mm,2.2uH?20%,4A,shd; Manufacturer Name: XR; Design Item ID: XRTC322520S2R2MBCA; Source: SamacSys.SchLib; Height: 1mm; JLC PN: C48391578; Manufacturer Part Number: XRTC322520S2R2MBCA
Q1 Q2 = CMP-00055-3: P-Channel 20 V 0.7 Ohm 0.27 W Enhancement Mode Mosfet - SOT-523; Manufacturer Name: Diodes Inc; Power Dissipation: 270mW; Rds On Max: 700mΩ; Drain to Source Voltage (Vdss): -20V; Gate to Source Voltage (Vgs): 6V; Max Operating Temperature: 150°C; Min Operating Temperature: -55°C; Mounting Technology: Surface Mount; Max Power Dissipation: 270mW; Case/Package: SOT-523; Pins: 3; JLC PN: C96676; Manufacturer Part Number: DMG1013T-7
R4 R6 R35 R43 = CMP-014-000077-5: 0402-10k-1%-1/16W-AEC-Q200; Manufacturer Name: YAGEO; Voltage Rating: 50V; Power: 63mW; Tolerance: 1%; Max Operating Temperature: 155°C; Case/Package: 0402; Mounting Technology: Surface Mount; Pins: 2; Min Operating Temperature: -55°C; Source: Components - 11.02.26 - 17.27.SchLib; Design Item ID: CMP-009-00191-3; Info: 0402-10k-1%-1/16W-AEC-Q200; Pin Count: 2; Component Type: Standard; Manufacturer Part Number: AC0402FR-0710KL; JLC PN: C144807
R7 R22 R30 R45 = CMP-014-000080-5: 0402-0-1A-AEC-Q200; Manufacturer Name: YAGEO; Current Rating: 1A; Voltage Rating: 50V; Manufacturer Part Number: AC0402JR-130RL; Pin Count: 2; Source: Components - 11.02.26 - 17.27.SchLib; Min Operating Temperature: -55°C; Component Type: Standard; Max Operating Temperature: 155°C; Design Item ID: CMP-009-00194-1; Mounting Technology: Surface Mount; Info: 0402-0-1A-AEC-Q200; Pins: 2; Case/Package: 0402; JLC PN: C4288031
R20 R36 = CMP-014-000101-4: 0402-34k-1%-1/16W-AEC-Q200; Manufacturer Name: YAGEO; Tolerance: 1%; Power: 63mW; Voltage Rating: 50V; Pins: 2; Pin Count: 2; Max Operating Temperature: 155°C; Case/Package: 0402; Info: 0402-34k-1%-1/16W-AEC-Q200; Component Type: Standard; Design Item ID: CMP-009-00208-2; Min Operating Temperature: -55°C; Source: Components - 11.02.26 - 17.27.SchLib; Manufacturer Part Number: AC0402FR-0734KL; Mounting Technology: Surface Mount; JLC PN: C227006
R29 = CMP-014-000115-4: 0402-7.5k-1%-1/16W-AEC-Q200; Manufacturer Name: Vishay; Manufacturer Part Number: CRCW04027K50FKED; Voltage Rating: 50V; Tolerance: 1%; Power: 63mW; Component Type: Standard; Pins: 2; Case/Package: 0402; Pin Count: 2; Info: 0402-7.5k-1%-1/16W-AEC-Q200; Max Operating Temperature: 155°C; Mounting Technology: Surface Mount; Design Item ID: CMP-009-00197-1; Min Operating Temperature: -55°C; Source: Components - 11.02.26 - 17.27.SchLib; JLC PN: C482236
R33 = CMP-014-000113-4: 0402-56k-1%-1/16W-AEC-Q200; Manufacturer Name: YAGEO; Tolerance: 1%; Voltage Rating: 50V; Power: 63mW; Min Operating Temperature: -55°C; Design Item ID: CMP-009-00210-1; Source: Components - 11.02.26 - 17.27.SchLib; Mounting Technology: Surface Mount; Manufacturer Part Number: AF0402FR-0756KL; Pins: 2; Max Operating Temperature: 155°C; Info: 0402-56k-1%-1/16W-AEC-Q200; Case/Package: 0402; JLC PN: C4288121
R34 = CMP-014-000114-4: 0402-30k-1%-1/16W-AEC-Q200; Manufacturer Name: YAGEO; Tolerance: 1%; Power: 63mW; Voltage Rating: 50V; Info: 0402-30k-1%-1/16W-AEC-Q200; Mounting Technology: Surface Mount; Source: Components - 11.02.26 - 17.27.SchLib; Max Operating Temperature: 155°C; Design Item ID: CMP-009-00210-1; Case/Package: 0402; Min Operating Temperature: -55°C; Pins: 2; Manufacturer Part Number: AC0402FR-0730KL; JLC PN: C412503
R37 = CMP-014-000106-4: 0402-3.3k-1%-1/16W-AEC-Q200; Manufacturer Name: Vishay; Power: 63mW; Tolerance: 1%; Voltage Rating: 50V; Mounting Technology: Surface Mount; Case/Package: 0402; Design Item ID: CMP-009-00197-1; Component Type: Standard; Info: 0402-3.3k-1%-1/16W-AEC-Q200; Min Operating Temperature: -55°C; Pin Count: 2; Source: Components - 11.02.26 - 17.27.SchLib; Pins: 2; Max Operating Temperature: 155°C; Manufacturer Part Number: CRCW04023K30FKED; JLC PN: C482167
R38 R41 R48 = CMP-014-000103-4: 0402-100k-1%-1/16W-AEC-Q200; Manufacturer Name: YAGEO; Tolerance: 1%; Voltage Rating: 50V; Power: 63mW; Min Operating Temperature: -55°C; Pin Count: 2; Component Type: Standard; Manufacturer Part Number: AC0402FR-07100KL; Design Item ID: CMP-009-00205-1; Source: Components - 11.02.26 - 17.27.SchLib; Mounting Technology: Surface Mount; Case/Package: 0402; Pins: 2; Info: 0402-100k-1%-1/16W-AEC-Q200; Max Operating Temperature: 155°C; JLC PN: C144809
R39 = CMP-014-000110-4: 0402-20k-1%-1/16W-AEC-Q200; Manufacturer Name: YAGEO; Tolerance: 1%; Power: 63mW; Voltage Rating: 50V; Source: Components - 11.02.26 - 17.27.SchLib; Design Item ID: CMP-009-00208-2; Component Type: Standard; Info: 0402-20k-1%-1/16W-AEC-Q200; Pin Count: 2; Pins: 2; Case/Package: 0402; Min Operating Temperature: -55°C; Manufacturer Part Number: AC0402FR-0720KL; Max Operating Temperature: 155°C; Mounting Technology: Surface Mount; JLC PN: C144783
R40 R47 = CMP-014-000112-2: 0603-5m-1%-0.5W-AECQ200; Manufacturer Name: YAGEO; Tolerance: 1%; Voltage Rating: 75V; Max Operating Temperature: 155°C; Case/Package: 0603; Info: 0603-5m-1%-0.5W-AECQ200; JLC PN: C1704788; Manufacturer Part Number: PA0603FRE570R005L; Min Operating Temperature: -55°C; Mounting Technology: Surface Mount
R42 = CMP-014-000116-4: 0402-60.4k-1%-1/16W-AEC-Q200; Manufacturer Name: YAGEO; Voltage Rating: 50V; Tolerance: 1%; Power: 63mW; Min Operating Temperature: -55°C; Pins: 2; Manufacturer Part Number: AC0402FR-0760K4L; Info: 0402-60.4k-1%-1/16W-AEC-Q200; Case/Package: 0402; Mounting Technology: Surface Mount; Design Item ID: CMP-009-00210-1; Source: Components - 11.02.26 - 17.27.SchLib; Max Operating Temperature: 155°C; JLC PN: C227168
R44 R52 = CMP-014-000105-4: 0402-120k-1%-1/16W-AEC-Q200; Manufacturer Name: YAGEO; Power: 63mW; Voltage Rating: 50V; Tolerance: 1%; Source: Components - 11.02.26 - 17.27.SchLib; Mounting Technology: Surface Mount; Pins: 2; Pin Count: 2; Manufacturer Part Number: AC0402FR-07120KL; Design Item ID: CMP-009-00205-1; Component Type: Standard; Case/Package: 0402; Min Operating Temperature: -55°C; Max Operating Temperature: 155°C; Info: 0402-120k-1%-1/16W-AEC-Q200; JLC PN: C144802
R46 R53 = CMP-014-000111-3: 0603-0-1A-AECQ200; Manufacturer Name: YAGEO; Voltage Rating: 75V; Tolerance: 1%; Mounting Technology: Surface Mount; JLC PN: C116699; Info: 0603-0-1A-AECQ200; Manufacturer Part Number: AC0603FR-070RL; Min Operating Temperature: -55°C; Max Operating Temperature: 155°C; Case/Package: 0603
R49 = CMP-014-000117-4: 0402-1.24k-1%-1/16W-AEC-Q200; Manufacturer Name: YAGEO; Voltage Rating: 50V; Power: 63mW; Tolerance: 1%; Pin Count: 2; Source: Components - 11.02.26 - 17.27.SchLib; Pins: 2; Case/Package: 0402; Max Operating Temperature: 155°C; Info: 0402-1.24k-1%-1/16W-AEC-Q200; Min Operating Temperature: -55°C; Design Item ID: CMP-009-00193-2; Mounting Technology: Surface Mount; Manufacturer Part Number: AC0402FR-071K24L; JLC PN: C226846
R50 = CMP-014-000110-4: 0402-20k-1%-1/16W-AEC-Q200; Manufacturer Name: YAGEO; Tolerance: 1%; Voltage Rating: 50V; Power: 63mW; Min Operating Temperature: -55°C; Pin Count: 2; Component Type: Standard; Manufacturer Part Number: AC0402FR-0720KL; Design Item ID: CMP-009-00208-2; Source: Components - 11.02.26 - 17.27.SchLib; Mounting Technology: Surface Mount; Case/Package: 0402; Pins: 2; Info: 0402-20k-1%-1/16W-AEC-Q200; Max Operating Temperature: 155°C; JLC PN: C144783
R51 = CMP-014-000104-4: 0402-150k-1%-1/16W-AEC-Q200; Manufacturer Name: YAGEO; Power: 63mW; Tolerance: 1%; Voltage Rating: 50V; Case/Package: 0402; Design Item ID: CMP-009-00195-1; Source: Components - 11.02.26 - 17.27.SchLib; Min Operating Temperature: -55°C; Component Type: Standard; Pins: 2; Mounting Technology: Surface Mount; Max Operating Temperature: 155°C; Info: 0402-150k-1%-1/16W-AEC-Q200; Manufacturer Part Number: AF0402FR-07150KL; Pin Count: 2; JLC PN: C144033
R54 R55 R58 = CMP-014-000107-4: 0402-2k-1%-1/16W-AEC-Q200; Manufacturer Name: YAGEO; Voltage Rating: 50V; Tolerance: 1%; Power: 63mW; Source: Components - 11.02.26 - 17.27.SchLib; Design Item ID: CMP-009-00190-1; Max Operating Temperature: 155°C; Mounting Technology: Surface Mount; Case/Package: 0402; Component Type: Standard; Min Operating Temperature: -55°C; Info: 0402-2k-1%-1/16W-AEC-Q200; Pins: 2; Manufacturer Part Number: AC0402FR-072KL; Pin Count: 2; JLC PN: C144770
R59 = CMP-014-000078-5: 0402-1k-1%-1/16W-AEC-Q200; Manufacturer Name: YAGEO; Voltage Rating: 50V; Power: 63mW; Tolerance: 1%; Manufacturer Part Number: AC0402FR-071KL; Pins: 2; Min Operating Temperature: -55°C; Max Operating Temperature: 155°C; Case/Package: 0402; Pin Count: 2; Source: Components - 11.02.26 - 17.27.SchLib; Mounting Technology: Surface Mount; Design Item ID: CMP-009-00192-1; Info: 0402-1k-1%-1/16W-AEC-Q200; Component Type: Standard; JLC PN: C144789
R60 R61 = CMP-014-000108-4: 0402-100-1%-1/16W-AEC-Q200; Manufacturer Name: YAGEO; Voltage Rating: 50V; Power: 63mW; Tolerance: 1%; Source: Components - 11.02.26 - 17.27.SchLib; Design Item ID: CMP-009-00202-1; Case/Package: 0402; Manufacturer Part Number: AC0402FR-07100RL; Mounting Technology: Surface Mount; Pin Count: 2; Component Type: Standard; Max Operating Temperature: 155°C; Pins: 2; Min Operating Temperature: -55°C; Info: 0402-100-1%-1/16W-AEC-Q200; JLC PN: C144808
R128 R135 = CMP-014-000077-5: as R25 on sheet Breakout_SoC; Pins: 2; Source: Components - 11.02.26 - 17.27.SchLib; Manufacturer Part Number: AC0402FR-0710KL; Info: 0402-10k-1%-1/16W-AEC-Q200; Min Operating Temperature: -55°C; Pin Count: 2; Case/Package: 0402; Design Item ID: CMP-009-00191-3; Max Operating Temperature: 155°C; Component Type: Standard; Mounting Technology: Surface Mount; JLC PN: C144807
R136 R137 = CMP-014-000093-5: 0402-2.49k-1%-1/16W-AECQ200; Manufacturer Name: YAGEO; Tolerance: 1%; Power: 63mW; Voltage Rating: 50V; Source: Components - 11.02.26 - 17.27.SchLib; Case/Package: 0402; Info: 0402-2.49k-1%-1/16W-AECQ200; Max Operating Temperature: 155°C; Pin Count: 2; Design Item ID: CMP-009-00207-1; Component Type: Standard; Manufacturer Part Number: AC0402FR-072K49L; Mounting Technology: Surface Mount; Pins: 2; Min Operating Temperature: -55°C; JLC PN: C226959
SW7 = CMP-051-000044-4: Dual 1.27mm SMT DIP Switch; Manufacturer Name: hanxia; JLC PN: C7430304; Manufacturer Part Number: HX 1.27-2PBJ TPPT
T3 T5 = CMP-00023-3: Board Connector, 2 Contact(s), 1 Row(s), Male, Straight, 0.1 inch Pitch, Solder Terminal, Locking, Black Insulator, Plug; Manufacturer Name: Wurth Electronik; Number Of Connectors: 1; Rated Current (Signal): 3A; Number of Contacts: 2; DIN Conformance: No; Option: General Purpose; Contact Style: SQ PIN-SKT; Reliability: COMMERCIAL; Insulation Resistance: 1GR; PCB Contact Pattern: RECTANGULAR; Contact Resistance: 20mR; Dielectric Withstanding Voltage (AC): 500V; Reference Standard: UL; Body Length: 0.2inch; Contact Gender: Male; Body/Shell Style: PLUG; Flammability Rating: UL94 V-0; Contact Finish - Mating: GOLD; Insulation Material: Polybutylene; Insulation Color: Black; Connector Type: BOARD CONNECTOR; Mounting Technology: Board; Reach SVHC Compliant: Yes; Mating Contact Pitch: 0.1inch; IEC Conformance: No; Body Breadth: 0.1inch; Mounting Option 1: LOCKING; Number of Rows Loaded: 1; RoHS Compliant: Yes; Terminal Length: 0.118inch; Terminal Pitch: 2.54mm; Termination: Solder; Contact Material: Copper Alloy; JESD-609 Code: e4; Body Depth: 0.1inch; Max Operating Temperature: 125°C; MIL Conformance: No; Mixed Contacts: No; Contact Finish - Termination: Gold (Au) - with Nickel (Ni) barrier; Mounting Style: STRAIGHT; Min Operating Temperature: -40°C; Filter Feature: No; Contact Pattern: RECTANGULAR; Manufacturer Part Number: 61300211121; JLC PN: C2915055
T10 T11 = CMP-016-000000-1: Test point 1 pin; Source: BWRC.SchLib; Design Item ID: TEST_PT
U2 U9 = CMP-102-000000-2: IC REG BUCK ADJ 4A SOT23 "Buck Switching Regulator IC Positive Adjustable 0.76V 1 Output 4A SOT-23-6 Thin, TSOT-23-6"; Manufacturer Name: Texas Instruments; Switching Frequency: 560kHz; Max Supply Voltage: 17V; Min Input Voltage: 4.5V; Min Output Voltage: 760mV; Max Output Voltage: 7V; Max Operating Temperature: 125°C; Output Current: 4A; Output Type: Adjustable; Case/Package: SOT-23-6; JLC PN: C464812; Topology: Buck; Min Operating Temperature: -40°C; Pins: 6; Manufacturer Part Number: TPS564201DDCR
U7 U10 U12 = CMP-017-000441-4: AP7167 Series 5.5 V 1.2 A Low Dropout Regulator with Pok - SOP-8EP; Manufacturer Name: Diodes Incorporated; Min Input Voltage: 2.2V; Max Output current: 1.2A; Max Power Dissipation: 1.9W; Output Voltage: 5V; Power Rating: 4W; Output Type: Adjustable; Max Supply Voltage: 5.5V; Dropout Voltage: 500mV; Height: 1.75mm; Min Operating Temperature: -40°C; Mounting Technology: Surface Mount; Max Operating Temperature: 85°C; RoHS: Compliant; Case/Package: SOIC; Output Current: 1.2A; JLC PN: C155313; Pins: 8; Manufacturer Part Number: AP7167-SPG-13
U8 = CMP-135-000000-4: 2-A, adjustable ultra-low-dropout voltage regulator with enable; Manufacturer Name: Texas Instruments; Max Output current: 2A; Dropout Voltage: 380mV; Min Input Voltage: 1.5V; Min Output Voltage: 900mV; Max Output Voltage: 5V; Max Supply Voltage: 6.5V; Package: HSOIC-8 Texas Instruments; JLC PN: C60719; Manufacturer Part Number: TPS7A7001DDAR; Min Operating Temperature: -40°C; Case/Package: SOIC; Pins: 8; Output Type: Adjustable; Max Operating Temperature: 125°C
U11 = CMP-051-000046-2: Digital Potentiometer 100kOhm 256POS Non-Volatile Linear 14-Pin X2QFN T/R; Manufacturer Name: Texas Instruments; Number of Channels: 2; Interface: I2C; Value: 100kΩ; Number of Positions: 256; Min Supply Voltage: 2.7V; Tolerance: 20%; Max Supply Voltage: 5.5V; Height: 400µm; JLC PN: C2649365; Case/Package: QFN; Composition: Potentiometer; Min Operating Temperature: -40°C; Max Operating Temperature: 85°C; Pins: 14; Manufacturer Part Number: TPL0102-100RUCR

## Sheet SODIMM.SchDoc
size C; DocumentNumber: 2; SheetNumber: 2; SheetTotal: 8
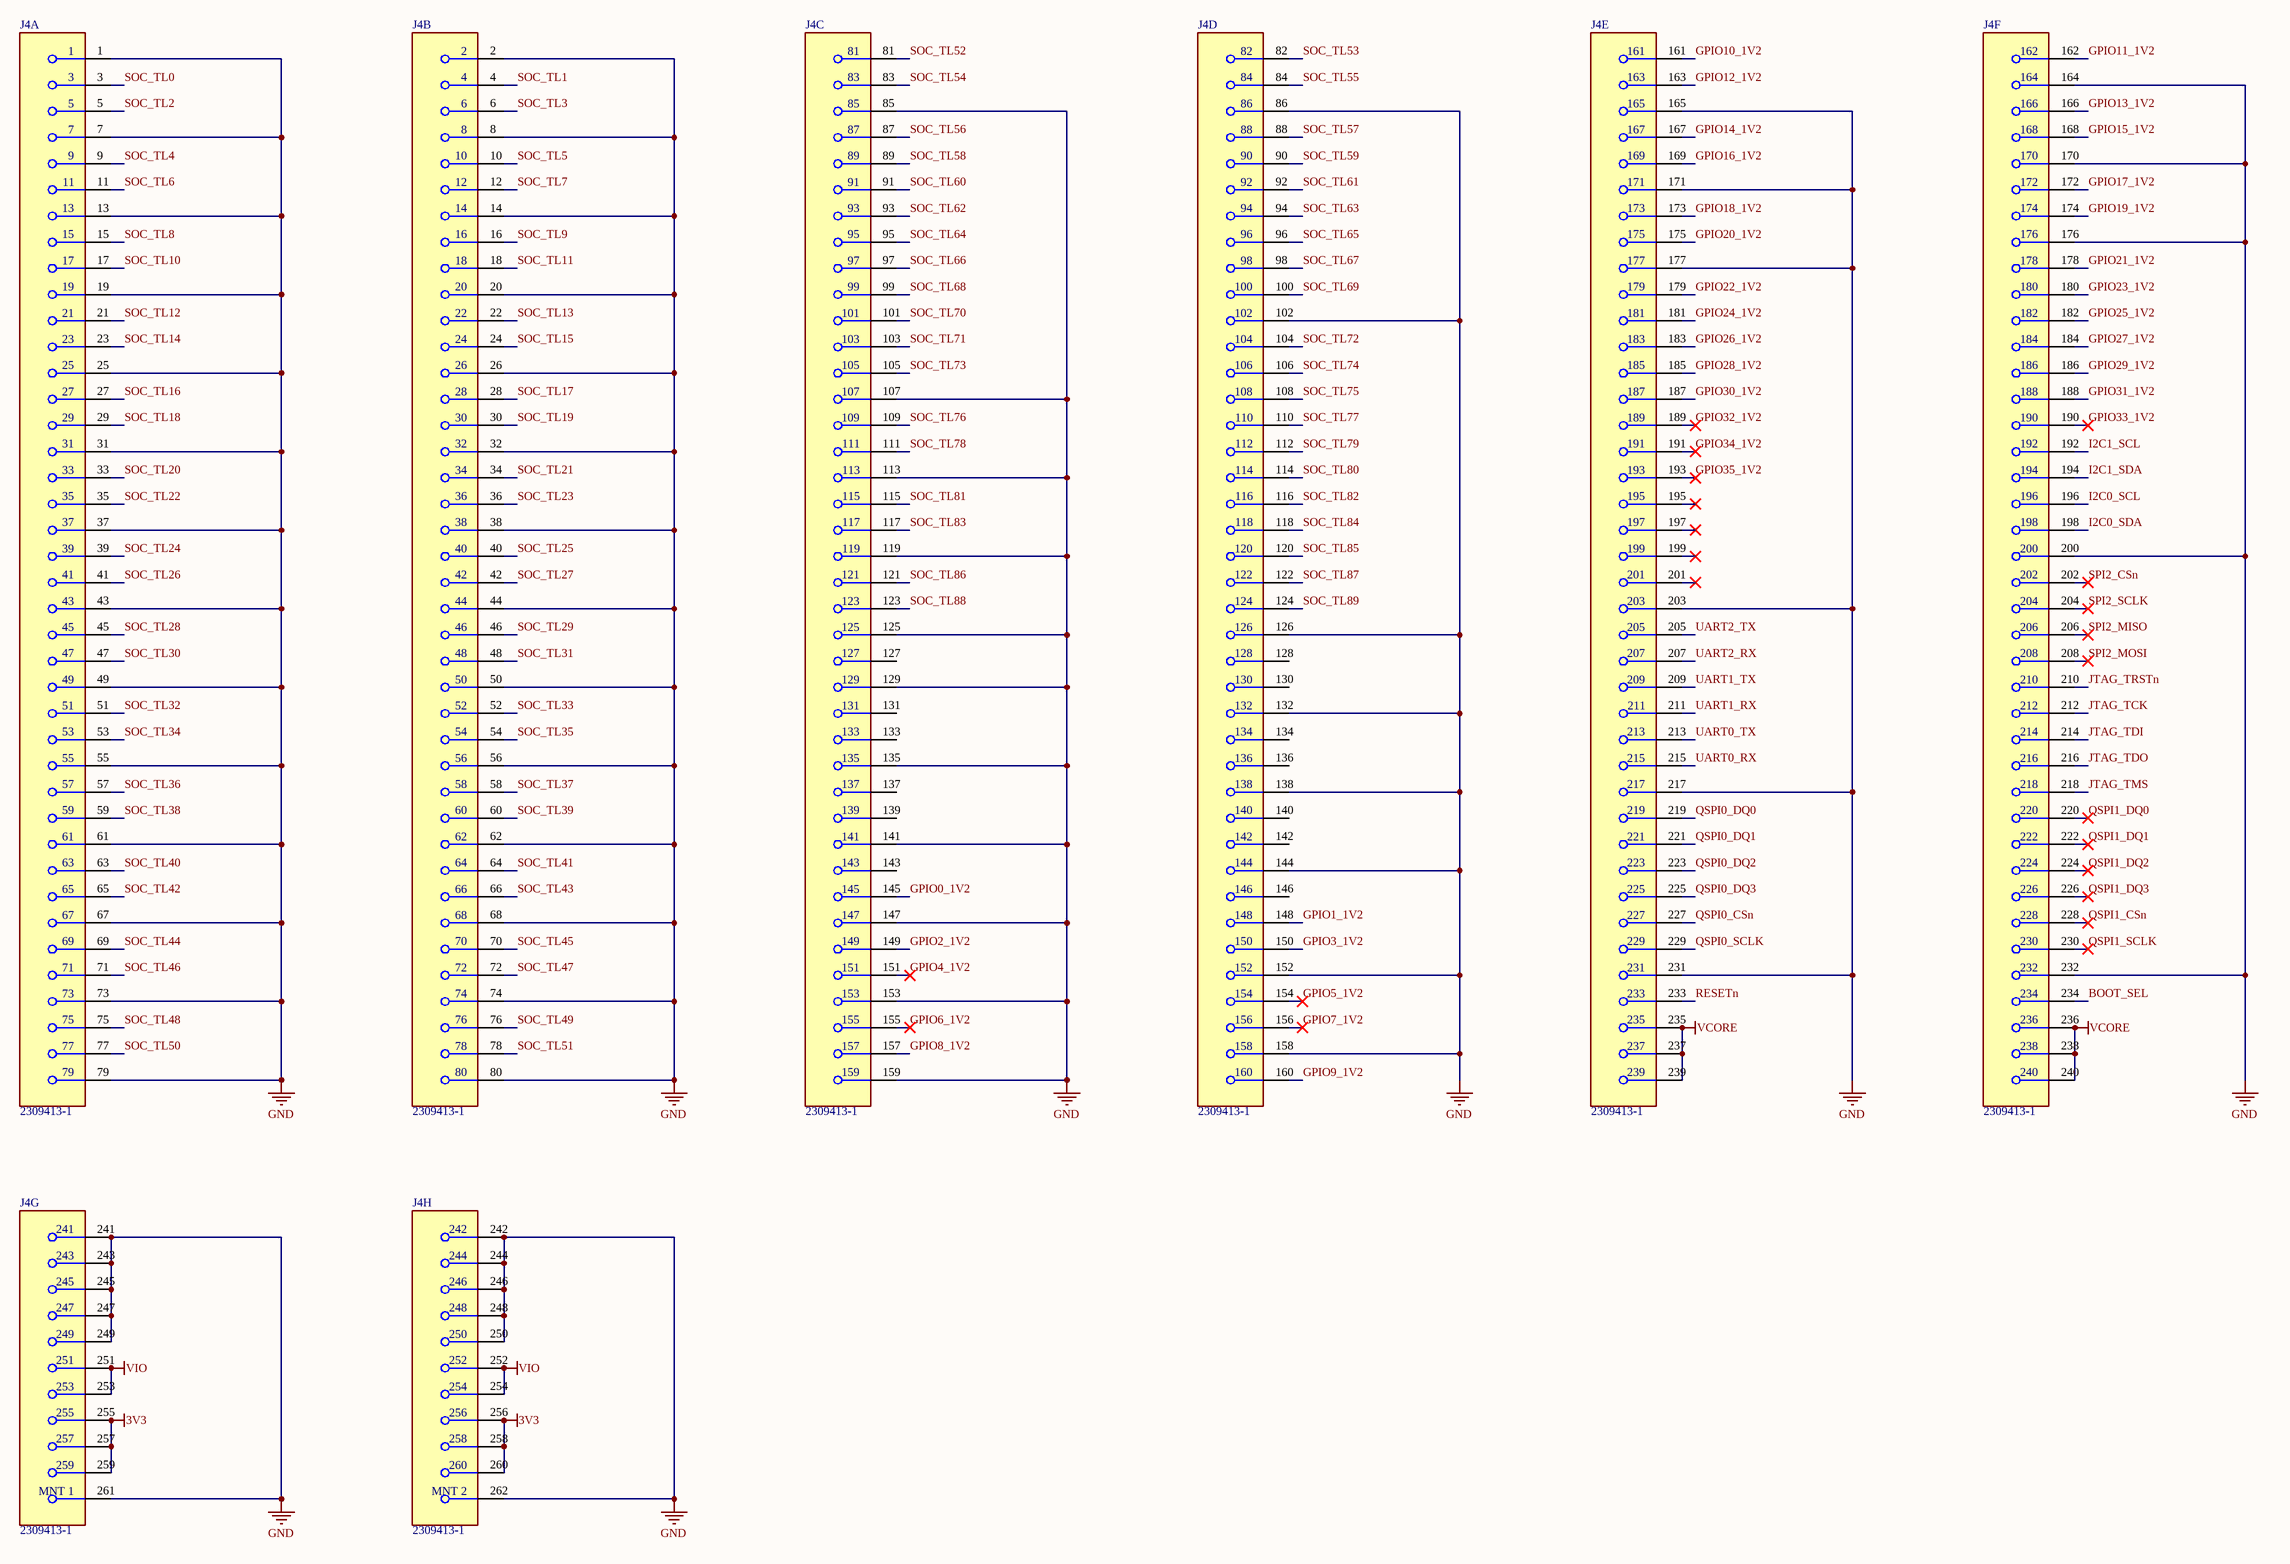
[diagram p3: SODIMM.SchDoc]

### Parts
J4  2309413-1  [FP-2309413-1-MFG]  (parts A,B,C,D,E,F,G,H of 8)

### Nets
3V3: J4.255 J4.256 J4.257 J4.258 J4.259 J4.260
GND: J4.1 J4.2 J4.7 J4.8 J4.13 J4.14 J4.19 J4.20 J4.25 J4.26 J4.31 J4.32 J4.37 J4.38 J4.43 J4.44 J4.49 J4.50 J4.55 J4.56 J4.61 J4.62 J4.67 J4.68 J4.73 J4.74 J4.79 J4.80 J4.85 J4.86 J4.102 J4.107 J4.113 J4.119 J4.125 J4.126 J4.129 J4.132 J4.135 J4.138 J4.141 J4.144 J4.147 J4.152 J4.153 J4.158 J4.159 J4.164 J4.165 J4.170 J4.171 J4.176 J4.177 J4.200 J4.203 J4.217 J4.231 J4.232 J4.241 J4.242 J4.243 J4.244 J4.245 J4.246 J4.247 J4.248 J4.249 J4.250 J4.261(MNT_1) J4.262(MNT_2)
VCORE: J4.235 J4.236 J4.237 J4.238 J4.239 J4.240
VIO: J4.251 J4.252 J4.253 J4.254
BOOT_SEL: J4.234
GPIO0_1V2: J4.145
GPIO1_1V2: J4.148
GPIO2_1V2: J4.149
GPIO3_1V2: J4.150
GPIO4_1V2: J4.151
GPIO5_1V2: J4.154
GPIO6_1V2: J4.155
GPIO7_1V2: J4.156
GPIO8_1V2: J4.157
GPIO9_1V2: J4.160
GPIO10_1V2: J4.161
GPIO11_1V2: J4.162
GPIO12_1V2: J4.163
GPIO13_1V2: J4.166
GPIO14_1V2: J4.167
GPIO15_1V2: J4.168
GPIO16_1V2: J4.169
GPIO17_1V2: J4.172
GPIO18_1V2: J4.173
GPIO19_1V2: J4.174
GPIO20_1V2: J4.175
GPIO21_1V2: J4.178
GPIO22_1V2: J4.179
GPIO23_1V2: J4.180
GPIO24_1V2: J4.181
GPIO25_1V2: J4.182
GPIO26_1V2: J4.183
GPIO27_1V2: J4.184
GPIO28_1V2: J4.185
GPIO29_1V2: J4.186
GPIO30_1V2: J4.187
GPIO31_1V2: J4.188
GPIO32_1V2: J4.189
GPIO33_1V2: J4.190
GPIO34_1V2: J4.191
GPIO35_1V2: J4.193
I2C0_SCL: J4.196
I2C0_SDA: J4.198
I2C1_SCL: J4.192
I2C1_SDA: J4.194
JTAG_TCK: J4.212
JTAG_TDI: J4.214
JTAG_TDO: J4.216
JTAG_TMS: J4.218
JTAG_TRSTn: J4.210
QSPI0_CSn: J4.227
QSPI0_DQ0: J4.219
QSPI0_DQ1: J4.221
QSPI0_DQ2: J4.223
QSPI0_DQ3: J4.225
QSPI0_SCLK: J4.229
QSPI1_CSn: J4.228
QSPI1_DQ0: J4.220
QSPI1_DQ1: J4.222
QSPI1_DQ2: J4.224
QSPI1_DQ3: J4.226
QSPI1_SCLK: J4.230
RESETn: J4.233
SOC_TL0: J4.3
SOC_TL1: J4.4
SOC_TL2: J4.5
SOC_TL3: J4.6
SOC_TL4: J4.9
SOC_TL5: J4.10
SOC_TL6: J4.11
SOC_TL7: J4.12
SOC_TL8: J4.15
SOC_TL9: J4.16
SOC_TL10: J4.17
SOC_TL11: J4.18
SOC_TL12: J4.21
SOC_TL13: J4.22
SOC_TL14: J4.23
SOC_TL15: J4.24
SOC_TL16: J4.27
SOC_TL17: J4.28
SOC_TL18: J4.29
SOC_TL19: J4.30
SOC_TL20: J4.33
SOC_TL21: J4.34
SOC_TL22: J4.35
SOC_TL23: J4.36
SOC_TL24: J4.39
SOC_TL25: J4.40
SOC_TL26: J4.41
SOC_TL27: J4.42
SOC_TL28: J4.45
SOC_TL29: J4.46
SOC_TL30: J4.47
SOC_TL31: J4.48
SOC_TL32: J4.51
SOC_TL33: J4.52
SOC_TL34: J4.53
SOC_TL35: J4.54
SOC_TL36: J4.57
SOC_TL37: J4.58
SOC_TL38: J4.59
SOC_TL39: J4.60
SOC_TL40: J4.63
SOC_TL41: J4.64
SOC_TL42: J4.65
SOC_TL43: J4.66
SOC_TL44: J4.69
SOC_TL45: J4.70
SOC_TL46: J4.71
SOC_TL47: J4.72
SOC_TL48: J4.75
SOC_TL49: J4.76
SOC_TL50: J4.77
SOC_TL51: J4.78
SOC_TL52: J4.81
SOC_TL53: J4.82
SOC_TL54: J4.83
SOC_TL55: J4.84
SOC_TL56: J4.87
SOC_TL57: J4.88
SOC_TL58: J4.89
SOC_TL59: J4.90
SOC_TL60: J4.91
SOC_TL61: J4.92
SOC_TL62: J4.93
SOC_TL63: J4.94
SOC_TL64: J4.95
SOC_TL65: J4.96
SOC_TL66: J4.97
SOC_TL67: J4.98
SOC_TL68: J4.99
SOC_TL69: J4.100
SOC_TL70: J4.101
SOC_TL71: J4.103
SOC_TL72: J4.104
SOC_TL73: J4.105
SOC_TL74: J4.106
SOC_TL75: J4.108
SOC_TL76: J4.109
SOC_TL77: J4.110
SOC_TL78: J4.111
SOC_TL79: J4.112
SOC_TL80: J4.114
SOC_TL81: J4.115
SOC_TL82: J4.116
SOC_TL83: J4.117
SOC_TL84: J4.118
SOC_TL85: J4.120
SOC_TL86: J4.121
SOC_TL87: J4.122
SOC_TL88: J4.123
SOC_TL89: J4.124
SPI2_CSn: J4.202
SPI2_MISO: J4.206
SPI2_MOSI: J4.208
SPI2_SCLK: J4.204
UART0_RX: J4.215
UART0_TX: J4.213
UART1_RX: J4.211
UART1_TX: J4.209
UART2_RX: J4.207
UART2_TX: J4.205

Not connected (* = marked no-connect by the designer): J4 127 128 130 131 133 134 136 137 139 140 142 143 146 195* 197* 199* 201*

### Library data of the parts
J4 = CMP-055-000104-3: Memory Card Connector, DDR4, SODIMM, Cam-In Locking, 260 Contacts, Copper Alloy; Manufacturer Name: TE Connectivity; Manufacturer Part Number: 2309413-1; JLC PN: C2766246